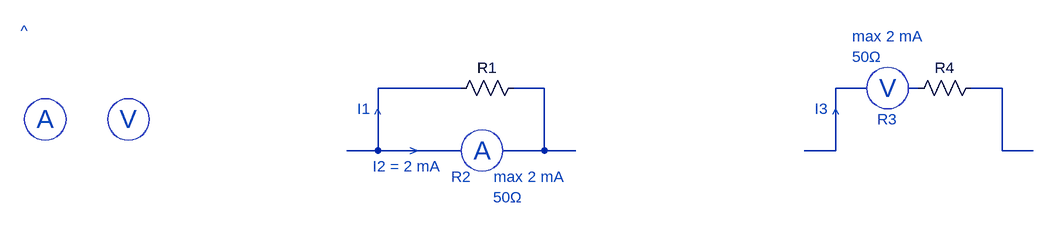
[diagram p0: schematic ELE112-2.asc]
ELE112-2.asc, the LTspice schematic file:
Version 4.1
SHEET 1 1508 680
WIRE 624 96 496 96
WIRE 752 96 704 96
WIRE 1248 96 1200 96
WIRE 1328 96 1312 96
WIRE 1456 96 1408 96
WIRE 496 192 496 96
WIRE 496 192 448 192
WIRE 624 192 496 192
WIRE 752 192 752 96
WIRE 752 192 688 192
WIRE 800 192 752 192
WIRE 1200 192 1200 96
WIRE 1200 192 1152 192
WIRE 1456 192 1456 96
WIRE 1504 192 1456 192
SYMBOL res 720 80 R90
WINDOW 0 0 56 VBottom 2
WINDOW 3 32 56 Invisible 2
SYMATTR InstName R1
SYMBOL res 1424 80 R90
WINDOW 0 0 56 VBottom 2
WINDOW 3 32 56 Invisible 2
SYMATTR InstName R4
TEXT -16 144 Center 4 ;A
TEXT 112 144 Center 4 ;V
TEXT 656 192 Center 4 ;A
TEXT 728 232 Center 2 ;max 2 mA
TEXT 696 264 Center 2 ;50Ω
TEXT -48 8 Center 2 ;^
TEXT 496 136 Center 2 ;^
TEXT 544 192 Left 2 ;>
TEXT 464 128 Left 2 ;I1
TEXT 488 216 Left 2 ;I2 = 2 mA
TEXT 1280 16 Center 2 ;max 2 mA
TEXT 1248 48 Center 2 ;50Ω
TEXT 1200 136 Center 2 ;^
TEXT 1168 128 Left 2 ;I3
TEXT 1280 96 Center 4 ;V
TEXT 624 232 Center 2 ;R2
TEXT 1264 144 Left 2 ;R3
CIRCLE Normal 16 176 -48 112
CIRCLE Normal 144 176 80 112
CIRCLE Normal 688 224 624 160
CIRCLE Normal 1312 128 1248 64

The netlist it stands for:
* ELE112-2.asc
R1 N002 N001 R
R4 N005 N004 R
* A
* V
* A
* max 2 mA
* 50Ω
* ^
* ^
* >
* I1
* I2 = 2 mA
* max 2 mA
* 50Ω
* ^
* I3
* V
* R2
* R3
.backanno
.end